# Altium schematic sheet BANK32-33.SchDoc
size A4
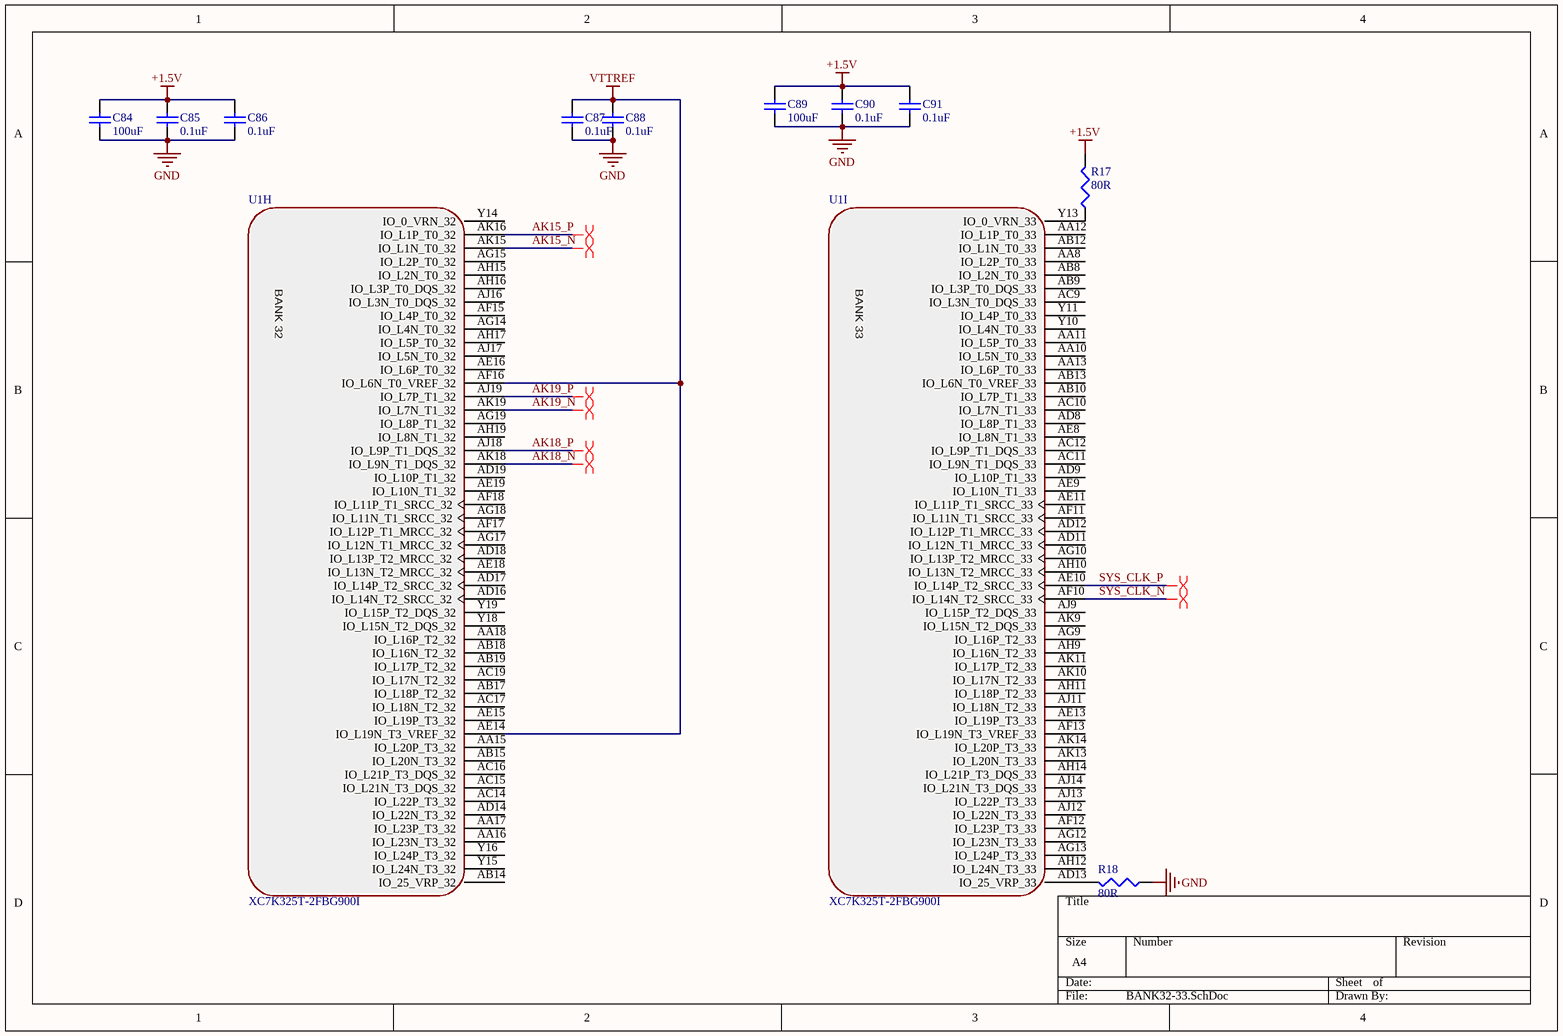
[diagram p0: BANK32-33.SchDoc]

## Parts
C84  value 100uF  [0402]  (hidden comment: Cap Semi)
C85  value 0.1uF  [0402]  (hidden comment: Cap Semi)
C86  value 0.1uF  [0402]  (hidden comment: Cap Semi)
C87  value 0.1uF  [0402]  (hidden comment: Cap Semi)
C88  value 0.1uF  [0402]  (hidden comment: Cap Semi)
C89  value 100uF  [0402]  (hidden comment: Cap Semi)
C90  value 0.1uF  [0402]  (hidden comment: Cap Semi)
C91  value 0.1uF  [0402]  (hidden comment: Cap Semi)
R17  value 80R  [J1-0603]  (hidden comment: Res3)
R18  value 80R  [J1-0603]  (hidden comment: Res3)
U1  XC7K325T-2FBG900I  (parts H,I of 17)

## Nets
+1.5V: C84.2 C85.2 C86.2 C89.2 C90.2 C91.2 R17.2
GND: C84.1 C85.1 C86.1 C87.1 C88.1 C89.1 C90.1 C91.1 R18.1
VTTREF: C87.2 C88.2 U1.AE14(IO_L19N_T3_VREF_32) U1.AF16(IO_L6N_T0_VREF_32)
AK15_N: U1.AK15(IO_L1N_T0_32)
AK15_P: U1.AK16(IO_L1P_T0_32)
AK18_N: U1.AK18(IO_L9N_T1_DQS_32)
AK18_P: U1.AJ18(IO_L9P_T1_DQS_32)
AK19_N: U1.AK19(IO_L7N_T1_32)
AK19_P: U1.AJ19(IO_L7P_T1_32)
SYS_CLK_N: U1.AF10(IO_L14N_T2_SRCC_33)
SYS_CLK_P: U1.AE10(IO_L14P_T2_SRCC_33)
NetR17_1: R17.1 U1.Y13(IO_0_VRN_33)
NetR18_2: R18.2 U1.AD13(IO_25_VRP_33)

Not connected (* = marked no-connect by the designer): U1 AA8(IO_L2P_T0_33) AA10(IO_L5N_T0_33) AA11(IO_L5P_T0_33) AA12(IO_L1P_T0_33) AA13(IO_L6P_T0_33) AA15(IO_L20P_T3_32) AA16(IO_L23N_T3_32) AA17(IO_L23P_T3_32) AA18(IO_L16P_T2_32) AB8(IO_L2N_T0_33) AB9(IO_L3P_T0_DQS_33) AB10(IO_L7P_T1_33) AB12(IO_L1N_T0_33) AB13(IO_L6N_T0_VREF_33) AB14(IO_25_VRP_32) AB15(IO_L20N_T3_32) AB17(IO_L18P_T2_32) AB18(IO_L16N_T2_32) AB19(IO_L17P_T2_32) AC9(IO_L3N_T0_DQS_33) AC10(IO_L7N_T1_33) AC11(IO_L9N_T1_DQS_33) AC12(IO_L9P_T1_DQS_33) AC14(IO_L22P_T3_32) AC15(IO_L21N_T3_DQS_32) AC16(IO_L21P_T3_DQS_32) AC17(IO_L18N_T2_32) AC19(IO_L17N_T2_32) AD8(IO_L8P_T1_33) AD9(IO_L10P_T1_33) AD11(IO_L12N_T1_MRCC_33) AD12(IO_L12P_T1_MRCC_33) AD14(IO_L22N_T3_32) AD16(IO_L14N_T2_SRCC_32) AD17(IO_L14P_T2_SRCC_32) AD18(IO_L13P_T2_MRCC_32) AD19(IO_L10P_T1_32) AE8(IO_L8N_T1_33) AE9(IO_L10N_T1_33) AE11(IO_L11P_T1_SRCC_33) AE13(IO_L19P_T3_33) AE15(IO_L19P_T3_32) AE16(IO_L6P_T0_32) AE18(IO_L13N_T2_MRCC_32) AE19(IO_L10N_T1_32) AF11(IO_L11N_T1_SRCC_33) AF12(IO_L23P_T3_33) AF13(IO_L19N_T3_VREF_33) AF15(IO_L4P_T0_32) AF17(IO_L12P_T1_MRCC_32) AF18(IO_L11P_T1_SRCC_32) AG9(IO_L16P_T2_33) AG10(IO_L13P_T2_MRCC_33) AG12(IO_L23N_T3_33) AG13(IO_L24P_T3_33) AG14(IO_L4N_T0_32) AG15(IO_L2P_T0_32) AG17(IO_L12N_T1_MRCC_32) AG18(IO_L11N_T1_SRCC_32) AG19(IO_L8P_T1_32) AH9(IO_L16N_T2_33) AH10(IO_L13N_T2_MRCC_33) AH11(IO_L18P_T2_33) AH12(IO_L24N_T3_33) AH14(IO_L21P_T3_DQS_33) AH15(IO_L2N_T0_32) AH16(IO_L3P_T0_DQS_32) AH17(IO_L5P_T0_32) AH19(IO_L8N_T1_32) AJ9(IO_L15P_T2_DQS_33) AJ11(IO_L18N_T2_33) AJ12(IO_L22N_T3_33) AJ13(IO_L22P_T3_33) AJ14(IO_L21N_T3_DQS_33) AJ16(IO_L3N_T0_DQS_32) AJ17(IO_L5N_T0_32) AK9(IO_L15N_T2_DQS_33) AK10(IO_L17N_T2_33) AK11(IO_L17P_T2_33) AK13(IO_L20N_T3_33) AK14(IO_L20P_T3_33) Y10(IO_L4N_T0_33) Y11(IO_L4P_T0_33) Y14(IO_0_VRN_32) Y15(IO_L24N_T3_32) Y16(IO_L24P_T3_32) Y18(IO_L15N_T2_DQS_32) Y19(IO_L15P_T2_DQS_32)

## Layout directives
differential pair: AK15_N, AK15_P, AK18_N, AK18_P, AK19_N, AK19_P, SYS_CLK_N, SYS_CLK_P

## Notes on the sheet
- (in symbol XC7K325T-2FBG900I, part H) BANK 32
- (in symbol XC7K325T-2FBG900I, part I) BANK 33

## Library data of the parts
C84-C91 = Cap Semi: Capacitor (Semiconductor SIM Model); Published: 8-Jun-2000; LatestRevisionDate: 29-May-2009; LatestRevisionNote: IPC-7351 Footprint Added.; PackageReference: C1206; Publisher: Altium Limited; PackageDescription: Chip Capacitor
R17 R18 = Res3: Resistor; Published: 8-Jun-2000; LatestRevisionDate: 29-May-2009; LatestRevisionNote: IPC-7351 Footprint Added.; PackageReference: J1-0603; Publisher: Altium Limited; PackageDescription: Chip Resistor